# Altium project MicroController.PrjPcb (part 1 of 2)
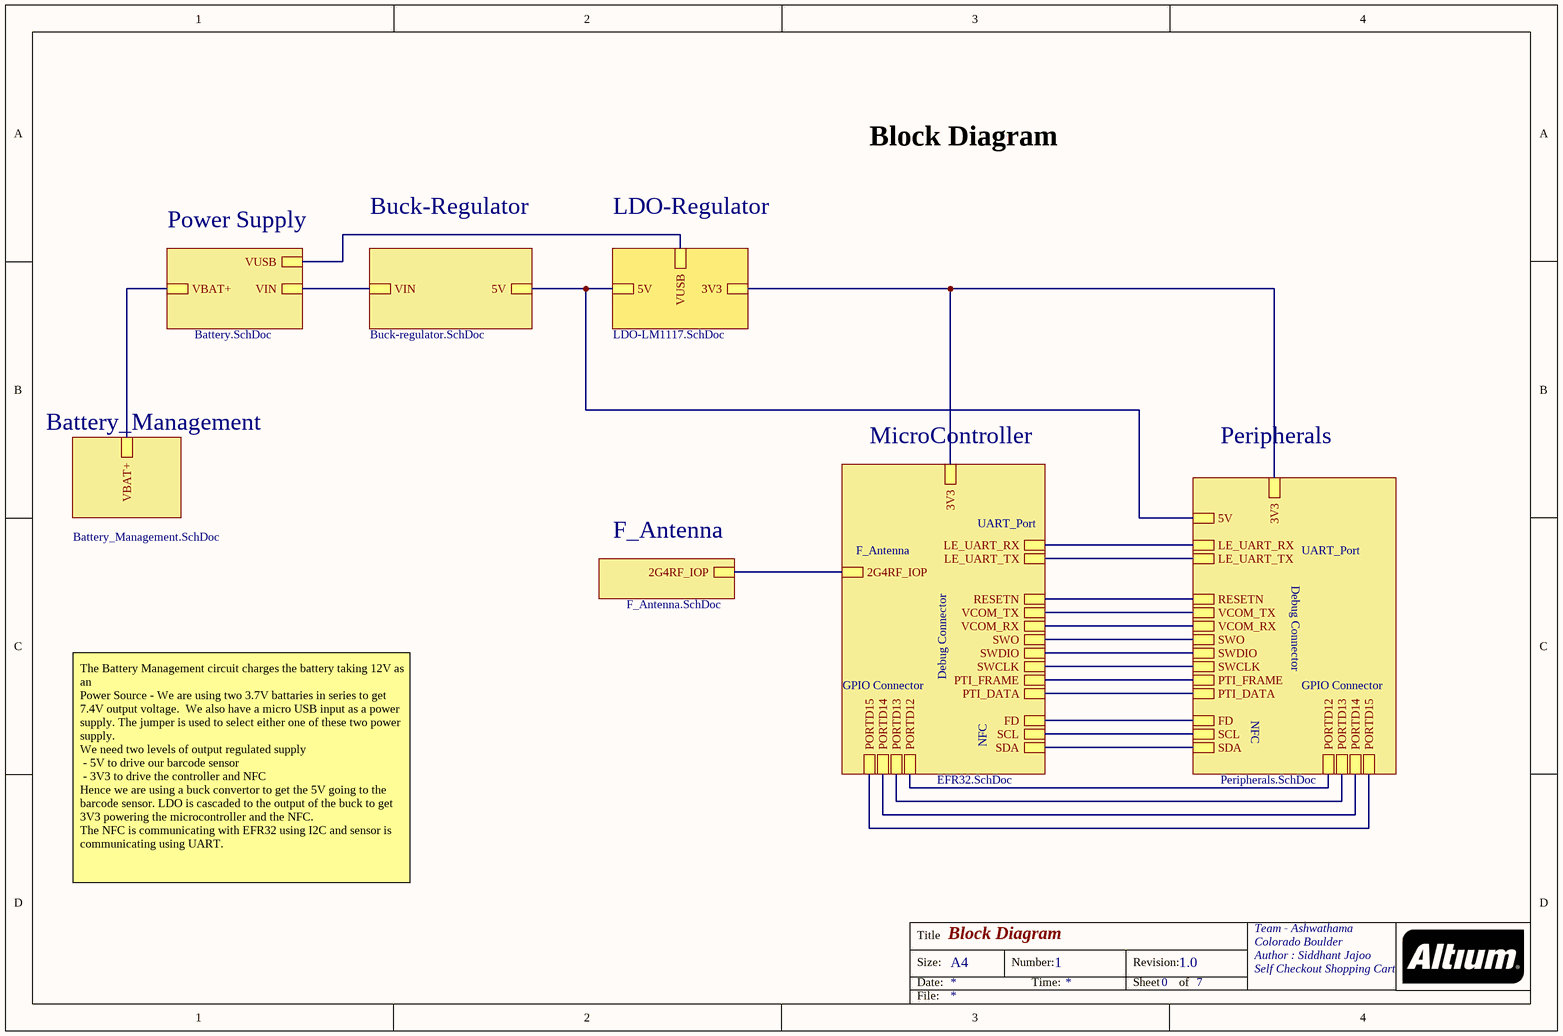
[diagram p0: Block_Diagram.SchDoc]
8 sheets, 76 parts. Net scope: hierarchical (ports join the sheet entries above them; power ports are global).
Board file: Shopping_Cart.PcbDoc
Sheets:
  Block_Diagram.SchDoc
    Buck-Regulator = Buck-regulator.SchDoc
    LDO-Regulator = LDO-LM1117.SchDoc
    F_Antenna = F_Antenna.SchDoc
    Peripherals = Peripherals.SchDoc
    MicroController = EFR32.SchDoc
    Power Supply = Battery.SchDoc
    Battery_Management = Battery_Management.SchDoc

## Sheet Block_Diagram.SchDoc: Block Diagram
size A4; DrawnBy: Siddhant Jajoo; Organization: Team - Ashwathama; Address1: Colorado Boulder; Address2: Author : Siddhant Jajoo; Address3: Self Checkout Shopping Cart; DocumentNumber: 1; Revision: 1.0; SheetNumber: 0; SheetTotal: 7; DocumentName: Block Diagram; ProjectName: Self Checkout Shopping Cart

### Sub-sheets
Battery_Management = Battery_Management.SchDoc: VBAT+
Buck-Regulator = Buck-regulator.SchDoc: VIN, 5V
F_Antenna = F_Antenna.SchDoc: 2G4RF_IOP
LDO-Regulator = LDO-LM1117.SchDoc: 3V3, 5V, VUSB
MicroController = EFR32.SchDoc: LE_UART_RX, LE_UART_TX, 2G4RF_IOP, SCL, SDA, 3V3, FD, RESETN, VCOM_TX, VCOM_RX, PTI_FRAME, PTI_DATA, SWO, SWDIO, SWCLK, PORTD12, PORTD13, PORTD14, PORTD15
Peripherals = Peripherals.SchDoc: PTI_FRAME, SWDIO, VCOM_TX, RESETN, FD, VCOM_RX, SWO, SWCLK, PTI_DATA, SCL, SDA, 3V3, LE_UART_RX, LE_UART_TX, 5V, PORTD12, PORTD13, PORTD14, PORTD15
Power Supply = Battery.SchDoc: VBAT+, VIN, VUSB

### Nets
3V3: sheet LDO-Regulator/3V3, sheet Peripherals/3V3, sheet MicroController/3V3
RESET_N: sheet Peripherals/RESETN, sheet MicroController/RESETN
NetC2_2: sheet Power Supply/VBAT+, sheet Battery_Management/VBAT+
NetC3_2: sheet Buck-Regulator/VIN, sheet Power Supply/VIN
NetD1_1: sheet LDO-Regulator/VUSB, sheet Power Supply/VUSB
NetJ4_3: sheet Buck-Regulator/5V, sheet LDO-Regulator/5V, sheet Peripherals/5V
NetJ7_1: sheet Peripherals/FD, sheet MicroController/FD
NetJ7_3: sheet Peripherals/SCL, sheet MicroController/SCL
NetJ7_4: sheet Peripherals/SDA, sheet MicroController/SDA
NetJ8_2: sheet Peripherals/LE_UART_TX, sheet MicroController/LE_UART_TX
NetJ8_3: sheet Peripherals/LE_UART_RX, sheet MicroController/LE_UART_RX
NetJ9_4: sheet Peripherals/VCOM_RX, sheet MicroController/VCOM_RX
NetJ9_5: sheet Peripherals/VCOM_TX, sheet MicroController/VCOM_TX
NetJ9_6: sheet Peripherals/SWO, sheet MicroController/SWO
NetJ9_7: sheet Peripherals/SWDIO, sheet MicroController/SWDIO
NetJ9_8: sheet Peripherals/SWCLK, sheet MicroController/SWCLK
NetJ9_9: sheet Peripherals/PTI_FRAME, sheet MicroController/PTI_FRAME
NetJ9_10: sheet Peripherals/PTI_DATA, sheet MicroController/PTI_DATA
NetJ10_1: sheet Peripherals/PORTD12, sheet MicroController/PORTD12
NetJ10_2: sheet Peripherals/PORTD13, sheet MicroController/PORTD13
NetJ10_3: sheet Peripherals/PORTD14, sheet MicroController/PORTD14
NetJ10_4: sheet Peripherals/PORTD15, sheet MicroController/PORTD15
NetL2_1: sheet F_Antenna/2G4RF_IOP, sheet MicroController/2G4RF_IOP

### Notes on the sheet
- Block Diagram
- F_Antenna
- UART_Port
- Debug Connector
- GPIO Connector
- NFC
- The Battery Management circuit charges the battery taking 12V as an
  Power Source - We are using two 3.7V battaries in series to get 7.4V output voltage.  We also have a micro USB input as a power supply. The jumper is used to select either one of these two power supply.
  We need two levels of output regulated supply
  - 5V to drive our barcode sensor
  - 3V3 to drive the controller and NFC
  Hence we are using a buck convertor to get the 5V going to the barcode sensor. LDO is cascaded to the output of the buck to get 3V3 powering the microcontroller and the NFC.
  The NFC is communicating with EFR32 using I2C and sensor is communicating using UART.
- Title
- Size:
- Date:
- A4
- Number:
- Time:
- Revision:
- Sheet
- of
- File:

## Sheet Buck-regulator.SchDoc: Buck Regulator
size A4; Organization: Team- Ashwathama; Address1: Colorado Boulder; Address2: Author- Satya Mehta; Address3: Self Checkout Shopping Cart; DocumentNumber: 1; Revision: 1.0; SheetNumber: 3; SheetTotal: 7
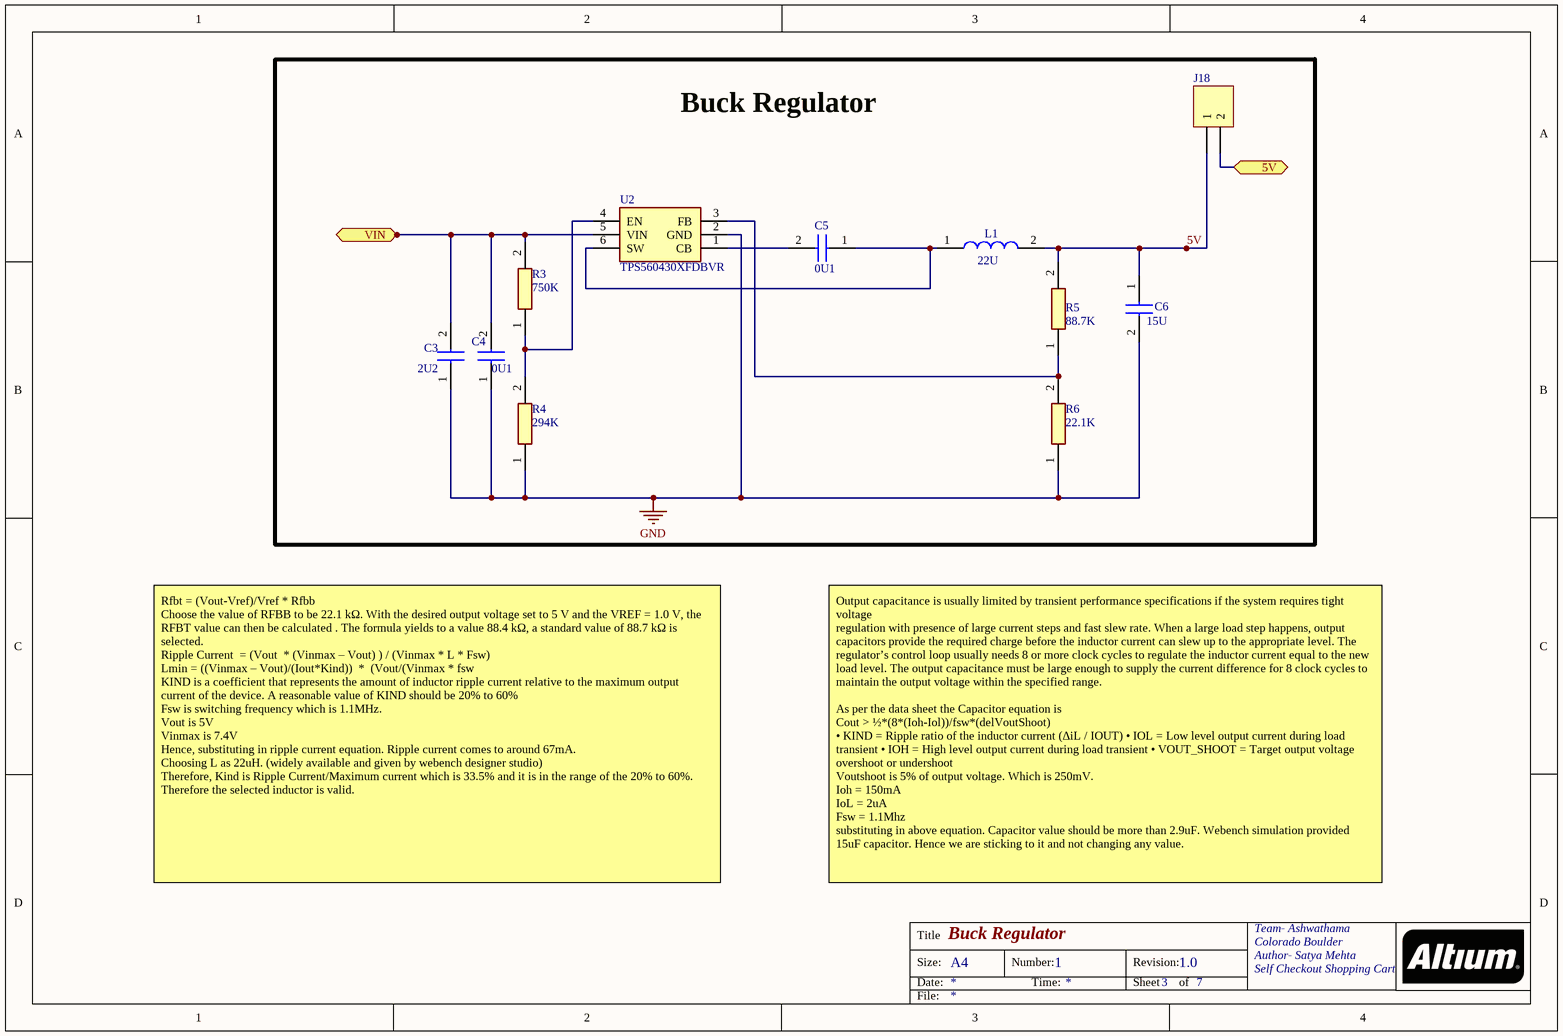
[diagram p1: Buck-regulator.SchDoc]

### Parts
C3  value 2U2  [CAPC2012X145N]  (hidden comment: GRM21BR71C225KA12L)
C4  value 0U1  [CAPC1608X87N]  (hidden comment: C0603C104K4RECTU)
C5  value 0U1  [CAPC1608X87N]  (hidden comment: C0603C104K4RECTU)
C6  value 15U  [CAPC1608X90N]  (hidden comment: GRM1885C2A150JA01D)
J18  Header 2  [HDR1X2]  (value not drawn)
L1  value 22U  [SRN3015]  (hidden comment: SRN3015-220M)
R3  value 750K  [RESC1608X55N]  (hidden comment: CR0603-FX-7503ELF)
R4  value 294K  [RESC1608X55N]  (hidden comment: CR0603-FX-2943ELF)
R5  value 88.7K  [RESC1608X50N]  (hidden comment: CRCW060388K7FKEA)
R6  value 22.1K  [RESC1608X55N]  (hidden comment: RC0603FR-0722K1L)
U2  TPS560430XFDBVR  [SOT95P280X145-6N]

### Blocks framed on the sheet
Buck Regulator: C3-C6 J18 L1 R3-R6 U2

### Ports
5V, VIN

### Nets
GND: C3.1 C4.1 C6.2 R4.1 R6.1 U2.2(GND)
5V: C6.1 J18.1 L1.2 R5.2
NetC3_2: C3.2 C4.2 R3.2 U2.5(VIN) ; port VIN
NetC5_1: C5.1 L1.1 U2.6(SW)
NetC5_2: C5.2 U2.1(CB)
NetJ4_3: J18.2 ; port 5V
NetR3_1: R3.1 R4.2 U2.4(EN)
NetR5_1: R5.1 R6.2 U2.3(FB)

### Notes on the sheet
- Rfbt = (Vout-Vref)/Vref * Rfbb
  Choose the value of RFBB to be 22.1 kΩ. With the desired output voltage set to 5 V and the VREF = 1.0 V, the RFBT value can then be calculated . The formula yields to a value 88.4 kΩ, a standard value of 88.7 kΩ is selected.
  Ripple Current  = (Vout  * (Vinmax – Vout) ) / (Vinmax * L * Fsw)
  Lmin = ((Vinmax – Vout)/(Iout*Kind))  *  (Vout/(Vinmax * fsw
  KIND is a coefficient that represents the amount of inductor ripple current relative to the maximum output current of the device. A reasonable value of KIND should be 20% to 60%
  Fsw is switching frequency which is 1.1MHz.
  Vout is 5V
  Vinmax is 7.4V
  Hence, substituting in ripple current equation. Ripple current comes to around 67mA.
  Choosing L as 22uH. (widely available and given by webench designer studio)
  Therefore, Kind is Ripple Current/Maximum current which is 33.5% and it is in the range of the 20% to 60%. Therefore the selected inductor is valid.
- Output capacitance is usually limited by transient performance specifications if the system requires tight voltage
  regulation with presence of large current steps and fast slew rate. When a large load step happens, output
  capacitors provide the required charge before the inductor current can slew up to the appropriate level. The
  regulator’s control loop usually needs 8 or more clock cycles to regulate the inductor current equal to the new
  load level. The output capacitance must be large enough to supply the current difference for 8 clock cycles to
  maintain the output voltage within the specified range.
  As per the data sheet the Capacitor equation is
  Cout > ½*(8*(Ioh-Iol))/fsw*(delVoutShoot)
  • KIND = Ripple ratio of the inductor current (ΔiL / IOUT) • IOL = Low level output current during load transient • IOH = High level output current during load transient • VOUT_SHOOT = Target output voltage overshoot or undershoot
  Voutshoot is 5% of output voltage. Which is 250mV.
  Ioh = 150mA
  IoL = 2uA
  Fsw = 1.1Mhz
  substituting in above equation. Capacitor value should be more than 2.9uF. Webench simulation provided 15uF capacitor. Hence we are sticking to it and not changing any value.
- Title
- Size:
- Date:
- A4
- Number:
- Time:
- Revision:
- Sheet
- of
- File:

### Library data of the parts
C3 = GRM21BR71C225KA12L: Capacitor; Manufacturer_Name: Murata Electronics; Datasheet Link: http://www.murata.com/~/media/webrenewal/support/library/catalog/products/capacitor/mlcc/c02e.pdf; Height: 1.45mm; Manufacturer_Part_Number: GRM21BR71C225KA12L; Mouser Part Number: 81-GRM21BR71C225KA2L; Mouser Price/Stock: https://www.mouser.com/Search/Refine.aspx?Keyword=81-GRM21BR71C225KA2L; RS Part Number: 7236076; RS Price/Stock: https://uk.rs-online.com/web/p/products/7236076
C4 C5 = C0603C104K4RECTU: Capacitor; Manufacturer_Name: Kemet; Datasheet Link: https://api.kemet.com/component-edge/download/datasheet/C0603C104K4RECTU.pdf; Height: 0.87mm; Manufacturer_Part_Number: C0603C104K4RECTU; Mouser Part Number: 80-C0603C104K4RECTU; Mouser Price/Stock: https://www.mouser.com/Search/Refine.aspx?Keyword=80-C0603C104K4RECTU
C6 = GRM1885C2A150JA01D: Capacitor; Manufacturer_Name: Murata Electronics; Datasheet Link: http://www.murata.com/~/media/webrenewal/support/library/catalog/products/capacitor/mlcc/c02e.pdf; Height: 0.9mm; Manufacturer_Part_Number: GRM1885C2A150JA01D; Mouser Part Number: 81-GRM1885C2A150JA01; Mouser Price/Stock: https://www.mouser.com/Search/Refine.aspx?Keyword=81-GRM1885C2A150JA01; RS Part Number: 8151516; RS Price/Stock: https://uk.rs-online.com/web/p/products/8151516
J18 = Header 2: Header, 2-Pin; Manufacturer_Part_Number: BG301-04-A-0540-L-B; Manufacturer_Name: Global Connector Technology; Digi-Key Part Number: 2073-BG301-02-A-0540-L-BCT-ND; Value: *; Digikey Price/Stock: https://www.digikey.com/product-detail/en/gct/BG301-04-A-0540-L-B/2073-BG301-04-A-0540-L-BCT-ND/9859670?utm_source=snapeda&utm_medium=aggregator&utm_campaign=symbol
L1 = SRN3015-220M: Inductor; Manufacturer_Name: Bourns; Allied_Number: 70231649; Manufacturer_Part_Number: SRN3015-220M; Digi-Key Part Number: SRN3015-220MCT-ND; Digikey Price/Stock: https://www.digikey.com/products/en/inductors-coils-chokes/fixed-inductors/71?k=SRN3015-220M&k=&pkeyword=SRN3015-220M&sv=0&pv7=2&sf=0&quantity=&ColumnSort=0&page=1&pageSize=25; RS Part Number: 7435087P; RS Price/Stock: http://uk.rs-online.com/web/p/products/7435087P; Allied Price/Stock: https://www.alliedelec.com/bourns-srn3015-220m/70231649/
R3 = CR0603-FX-7503ELF: Resistor; Manufacturer_Name: Bourns; Datasheet Link: https://www.bourns.com/pdfs/chpreztr.pdf; Height: 0.55mm; Manufacturer_Part_Number: CR0603-FX-7503ELF; Mouser Part Number: 652-CR0603FX-7503ELF; Mouser Price/Stock: https://www.mouser.com/Search/Refine.aspx?Keyword=652-CR0603FX-7503ELF
R4 = CR0603-FX-2943ELF: Resistor; Manufacturer_Name: Bourns; Datasheet Link: https://www.bourns.com/pdfs/chpreztr.pdf; Height: 0.55mm; Manufacturer_Part_Number: CR0603-FX-2943ELF; Mouser Part Number: 652-CR0603FX-2943ELF; Mouser Price/Stock: https://www.mouser.com/Search/Refine.aspx?Keyword=652-CR0603FX-2943ELF
R5 = CRCW060388K7FKEA: Resistor; Manufacturer_Name: Vishay; Allied_Number: 70203516; Datasheet Link: http://www.vishay.com/docs/20035/dcrcwe3.pdf; Height: 0.5mm; Manufacturer_Part_Number: CRCW060388K7FKEA; Mouser Part Number: 71-CRCW0603-88.7K-E3; RS Part Number: 8306693; RS Price/Stock: https://uk.rs-online.com/web/p/products/8306693; Allied Price/Stock: https://www.alliedelec.com/vishay-dale-crcw060388k7fkea/70203516/; Mouser Price/Stock: https://www.mouser.com/ProductDetail/Vishay-Dale/CRCW060388K7FKEA?qs=sGAEpiMZZMu61qfTUdNhG%2Fy1ga03FwuGzQj1%2FlSzSQI%3D
R6 = RC0603FR-0722K1L: Resistor; Manufacturer_Name: YAGEO (PHYCOMP); Datasheet Link: http://www.yageo.com/documents/recent/PYu-RC0603_51_RoHS_L_v5.pdf; Height: 0.55mm; Manufacturer_Part_Number: RC0603FR-0722K1L; Mouser Part Number: 603-RC0603FR-0722K1L; Mouser Price/Stock: https://www.mouser.com/Search/Refine.aspx?Keyword=603-RC0603FR-0722K1L
U2 = TPS560430XFDBVR: Integrated Circuit; Manufacturer_Name: Texas Instruments; Datasheet Link: http://www.ti.com/lit/ds/symlink/tps560430.pdf; Height: 1.45mm; Manufacturer_Part_Number: TPS560430XFDBVR; Mouser Part Number: 595-TPS560430XFDBVR; Mouser Price/Stock: https://www.mouser.com/Search/Refine.aspx?Keyword=595-TPS560430XFDBVR

## Sheet LDO-LM1117.SchDoc: LDO Regulator
size A4; Organization: Team Ashwathama; Address1: Colorado Boulder; Address2: Author- Satya Mehta; Address3: Self Checkout Shopping Cart; DocumentNumber: 1; Revision: 1.0; SheetNumber: 4; SheetTotal: 7
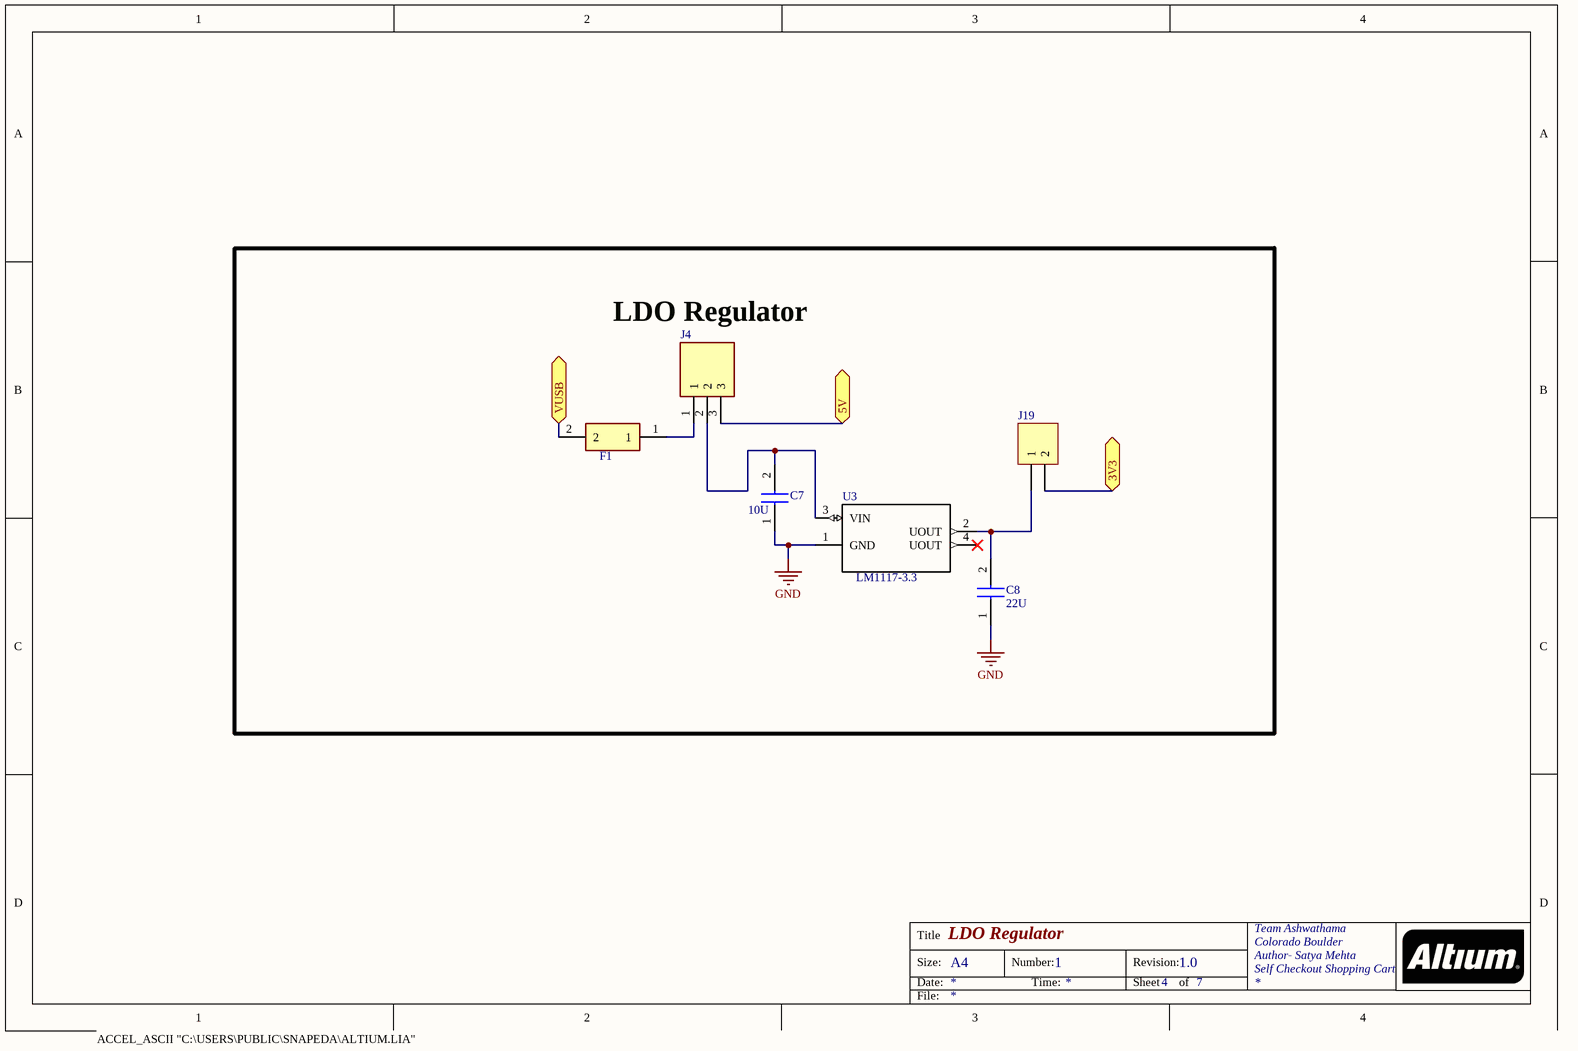
[diagram p2: LDO-LM1117.SchDoc]

### Parts
C7  value 10U  [CAPC6153X300N]  (hidden comment: KCM55LR71E156KH01K)
C8  value 22U  [CAPC3225X270N]  (hidden comment: GRM32ER71C226KEA8L)
F1  MF-MSMF050-2  [FUSC4632X85N]  (value not drawn)
J4  61900311121  [SHDR3W64P0X254_1X3_766X580X1175P]  (value not drawn)
J19  Header 2  [HDR1X2]  (value not drawn)
U3  LM1117-3.3  [*SOT-223]

### Blocks framed on the sheet
LDO Regulator: C7 C8 F1 J4 J19 U3

### Ports
3V3, 5V, VUSB

### Nets
GND: C7.1 C8.1 U3.1(GND)
3V3: J19.2 ; port 3V3
NetC7_2: C7.2 J4.2 U3.3(VIN)
NetC8_2: C8.2 J19.1 U3.2(UOUT)
NetD1_1: F1.2 ; port VUSB
NetF1_1: F1.1 J4.1
NetJ4_3: J4.3 ; port 5V

Not connected (* = marked no-connect by the designer): U3 4(UOUT)*

### Notes on the sheet
- ACCEL_ASCII "C:\USERS\PUBLIC\SNAPEDA\ALTIUM.LIA"
  (asciiHeader
  (asciiVersion 5 0)
  (fileAuthor "(c) SnapEDA 2016 (snapeda.com)")
  (copyright "This work is licensed under a Creative Commons Attribution-ShareAlike 4.0 International License (CC BY-SA) with Design Exception 1.0")
  (fileUnits mm)
  )
  (library "Library"
  (padStyleDef "SSX45Y13"
  (holeDiam 0)
  (startRange 1)
  (endRange 2)
  (padShape (layerNumRef 1) (padShapeType Rect) (shapeWidth 0.45) (shapeHeight 1.38))
  (padShape (layerNumRef 2) (padShapeType Rect) (shapeWidth 0) (shapeHeight 0))
  (padShape (layerType Signal) (padShapeType Rect) (shapeWidth 0) (shapeHeight 0))
  (padShape (padShapeType Rect) (shapeWidth 0.45) (shapeHeight 1.38))
  (padShape (padShapeType Rect) (shapeWidth 0.45) (shapeHeight 1.38))
  (padShape (layerType Plane) (padShapeType NoConnect) (shapeWidth 0) (shapeHeight 0))
  (padShape (layerType NonSignal) (padShapeType Oval) (shapeWidth 0) (shapeHeight 0))
  )
  (padStyleDef "SSX14Y21"
  (holeDiam 0)
  (startRange 1)
  (endRange 2)
  (padShape (layerNumRef 1) (padShapeType Rect) (shapeWidth 1.4) (shapeHeight 2.1))
  (padShape (layerNumRef 2) (padShapeType Rect) (shapeWidth 0) (shapeHeight 0))
  (padShape (layerType Signal) (padShapeType Rect) (shapeWidth 0) (shapeHeight 0))
  (padShape (padShapeType Rect) (shapeWidth 1.4) (shapeHeight 2.1))
  (padShape (padShapeType Rect) (shapeWidth 1.4) (shapeHeight 2.1))
  (padShape (layerType Plane) (padShapeType NoConnect) (shapeWidth 0) (shapeHeight 0))
  (padShape (layerType NonSignal) (padShapeType Oval) (shapeWidth 0) (shapeHeight 0))
  )
  (padStyleDef "SSX13Y21"
  (holeDiam 0)
  (startRange 1)
  (endRange 2)
  (padShape (layerNumRef 1) (padShapeType Rect) (shapeWidth 1.375) (shapeHeight 2.1))
  (padShape (layerNumRef 2) (padShapeType Rect) (shapeWidth 0) (shapeHeight 0))
  (padShape (layerType Signal) (padShapeType Rect) (shapeWidth 0) (shapeHeight 0))
  (padShape (padShapeType Rect) (shapeWidth 1.375) (shapeHeight 2.1))
  (padShape (padShapeType Rect) (shapeWidth 1.375) (shapeHeight 2.1))
  (padShape (layerType Plane) (padShapeType NoConnect) (shapeWidth 0) (shapeHeight 0))
  (padShape (layerType NonSignal) (padShapeType Oval) (shapeWidth 0) (shapeHeight 0))
  )
  (padStyleDef "DUD60"
  (holeDiam 0.6)
  (isHolePlated False)
  (startRange 1)
  (endRange 2)
  (padShape (layerNumRef 1) (padShapeType Oval) (shapeWidth 0.6) (shapeHeight 0.6))
  (padShape (layerNumRef 2) (padShapeType Oval) (shapeWidth 0.6) (shapeHeight 0.6))
  (padShape (layerType Signal) (padShapeType Oval) (shapeWidth 0.6) (shapeHeight 0.6))
  (padShape (layerType Plane) (padShapeType NoConnect) (shapeWidth 0) (shapeHeight 0))
  (padShape (layerType NonSignal) (padShapeType Oval) (shapeWidth 0) (shapeHeight 0))
  )
  (padStyleDef "SSX10Y10"
  (holeDiam 0)
  (startRange 1)
  (endRange 2)
  (padShape (layerNumRef 1) (padShapeType Rect) (shapeWidth 0.1) (shapeHeight 0.1))
  (padShape (layerNumRef 2) (padShapeType Rect) (shapeWidth 0) (shapeHeight 0))
  (padShape (layerType Signal) (padShapeType Rect) (shapeWidth 0) (shapeHeight 0))
  (padShape (padShapeType Rect) (shapeWidth 0) (shapeHeight 0))
  (padShape (padShapeType Rect) (shapeWidth 0) (shapeHeight 0))
  (padShape (layerType Plane) (padShapeType NoConnect) (shapeWidth 0) (shapeHeight 0))
  (padShape (layerType NonSignal) (padShapeType Oval) (shapeWidth 0) (shapeHeight 0))
  )
  (textStyleDef "(Default)"
  (font
  (fontType Stroke)
  (fontFamily Modern)
  (fontFace "Quality")
  (fontHeight 3.54)
  )
  (textStyleAllowTType True)
  (textStyleDisplayTType False)
  )
  (textStyleDef "(PinStyle)"
  (font
  (fontType Stroke)
  (fontFamily SanSerif)
  (fontFace "QUALITY")
  (fontHeight 3.54)
  (strokeWidth 0.001)
  )
  (font
  (fontType TrueType)
  (fontFamily Modern)
  (fontFace "Times New Roman")
  (fontHeight 3.54)
  (strokeWidth 0.19843)
  (fontWeight 400)
  (fontCharSet 0)
  (fontOutPrecision 7)
  (fontClipPrecision 32)
  (fontQuality 1)
  (fontPitchAndFamily 6)
  )
  (textStyleAllowTType True)
  (textStyleDisplayTType False)
  )
  (textStyleDef "(LabelStyle)"
  (font
  (fontType Stroke)
  (fontFamily SanSerif)
  (fontFace "QUALITY")
  (fontHeight 3.54)
  (strokeWidth 0.001)
  )
  (font
  (fontType TrueType)
  (fontFamily Modern)
  (fontFace "Times New Roman")
  (fontHeight 3)
  (strokeWidth 0.19843)
  (fontWeight 400)
  (fontCharSet 0)
  (fontOutPrecision 7)
  (fontClipPrecision 32)
  (fontQuality 1)
  (fontPitchAndFamily 6)
  )
  (textStyleAllowTType True)
  (textStyleDisplayTType False)
  )
  (patternDefExtended "*TE_1932788-1"
  (originalName "*TE_1932788-1")
  (patternGraphicsNameRef "Primary")
  (patternGraphicsDef
  (patternGraphicsNameDef "Primary")
  (multiLayer
  (pad (padNum 3) (padStyleRef "SSX45Y13") (pt 0 0))
  (pad (padNum SH1) (padStyleRef "SSX14Y21") (pt -2.5 -0.36))
  (pad (padNum SH2) (padStyleRef "SSX14Y21") (pt 2.5 -0.36))
  (pad (padNum SH5) (padStyleRef "SSX13Y21") (pt -0.9375 -2.71))
  (pad (padNum 2) (padStyleRef "SSX45Y13") (pt -0.65 0))
  (pad (padNum 4) (padStyleRef "SSX45Y13") (pt 0.65 0))
  (pad (padNum 1) (padStyleRef "SSX45Y13") (pt -1.3 0))
  (pad (padNum 5) (padStyleRef "SSX45Y13") (pt 1.3 0))
  (pad (padNum SH4) (padStyleRef "SSX13Y21") (pt 0.9375 -2.71))
  (pad (padNum None) (padStyleRef "DUD60") (pt -3.95 -2.66))
  (pad (padNum None) (padStyleRef "DUD60") (pt 3.95 -2.66))
  (pad (padNum SH3) (padStyleRef "SSX10Y10") (pt 4 -3.5))
  (pad (padNum SH6) (padStyleRef "SSX10Y10") (pt -4 -3.5))
  )
  (layerContents (layerNumRef 1)
  (pcbPoly
  (pt 3.65 -2.66)
  (pt 3.65 -2.31)
  (pt 3.65 -2.30215)
  (pt 3.65082 -2.28646)
  (pt 3.65246 -2.27083)
  (pt 3.65492 -2.25531)
  (pt 3.65819 -2.23994)
  (pt 3.66226 -2.22477)
  (pt 3.66711 -2.20983)
  (pt 3.67274 -2.19516)
  (pt 3.67913 -2.1808)
  (pt 3.68626 -2.1668)
  (pt 3.69412 -2.1532)
  (pt 3.70268 -2.14002)
  (pt 3.71191 -2.12731)
  (pt 3.7218 -2.1151)
  (pt 3.73231 -2.10342)
  (pt 3.74342 -2.09231)
  (pt 3.7551 -2.0818)
  (pt 3.76731 -2.07191)
  (pt 3.78002 -2.06268)
  (pt 3.7932 -2.05412)
  (pt 3.8068 -2.04627)
  (pt 3.8208 -2.03913)
  (pt 3.83515 -2.03274)
  (pt 3.84982 -2.02711)
  (pt 3.86476 -2.02226)
  (pt 3.87994 -2.01819)
  (pt 3.89531 -2.01492)
  (pt 3.91083 -2.01246)
  (pt 3.92645 -2.01082)
  (pt 3.94214 -2.01)
  (pt 3.95 -2.01)
  (pt 3.95785 -2.01)
  (pt 3.97354 -2.01082)
  (pt 3.98917 -2.01246)
  (pt 4.00469 -2.01492)
  (pt 4.02006 -2.01819)
  (pt 4.03523 -2.02226)
  (pt 4.05017 -2.02711)
  (pt 4.06484 -2.03274)
  (pt 4.0792 -2.03913)
  (pt 4.0932 -2.04626)
  (pt 4.1068 -2.05412)
  (pt 4.11998 -2.06268)
  (pt 4.13269 -2.07191)
  (pt 4.1449 -2.0818)
  (pt 4.15658 -2.09231)
  (pt 4.16769 -2.10342)
  (pt 4.1782 -2.1151)
  (pt 4.18809 -2.12731)
  (pt 4.19732 -2.14002)
  (pt 4.20588 -2.1532)
  (pt 4.21373 -2.1668)
  (pt 4.22087 -2.1808)
  (pt 4.22726 -2.19515)
  (pt 4.23289 -2.20982)
  (pt 4.23774 -2.22476)
  (pt 4.24181 -2.23994)
  (pt 4.24508 -2.25531)
  (pt 4.24754 -2.27083)
  (pt 4.24918 -2.28645)
  (pt 4.25 -2.30214)
  (pt 4.25 -2.31)
  (pt 4.25 -3.01)
  (pt 4.25 -3.01785)
  (pt 4.24918 -3.03354)
  (pt 4.24754 -3.04917)
  (pt 4.24508 -3.06469)
  (pt 4.24181 -3.08006)
  (pt 4.23774 -3.09523)
  (pt 4.23289 -3.11017)
  (pt 4.22726 -3.12484)
  (pt 4.22087 -3.1392)
  (pt 4.21374 -3.1532)
  (pt 4.20588 -3.1668)
  (pt 4.19732 -3.17998)
  (pt 4.18809 -3.19269)
  (pt 4.1782 -3.2049)
  (pt 4.16769 -3.21658)
  (pt 4.15658 -3.22769)
  (pt 4.1449 -3.2382)
  (pt 4.13269 -3.24809)
  (pt 4.11998 -3.25732)
  (pt 4.1068 -3.26588)
  (pt 4.0932 -3.27373)
  (pt 4.0792 -3.28087)
  (pt 4.06485 -3.28726)
  (pt 4.05018 -3.29289)
  (pt 4.03524 -3.29774)
  (pt 4.02006 -3.30181)
  (pt 4.00469 -3.30508)
  (pt 3.98917 -3.30754)
  (pt 3.97355 -3.30918)
  (pt 3.95786 -3.31)
  (pt 3.95 -3.31)
  (pt 3.94215 -3.31)
  (pt 3.92646 -3.30918)
  (pt 3.91083 -3.30754)
  (pt 3.89531 -3.30508)
  (pt 3.87994 -3.30181)
  (pt 3.86477 -3.29774)
  (pt 3.84983 -3.29289)
  (pt 3.83516 -3.28726)
  (pt 3.8208 -3.28087)
  (pt 3.8068 -3.27374)
  (pt 3.7932 -3.26588)
  (pt 3.78002 -3.25732)
  (pt 3.76731 -3.24809)
  (pt 3.7551 -3.2382)
  (pt 3.74342 -3.22769)
  (pt 3.73231 -3.21658)
  (pt 3.7218 -3.2049)
  (pt 3.71191 -3.19269)
  (pt 3.70268 -3.17998)
  (pt 3.69412 -3.1668)
  (pt 3.68627 -3.1532)
  (pt 3.67913 -3.1392)
  (pt 3.67274 -3.12485)
  (pt 3.66711 -3.11018)
  (pt 3.66226 -3.09524)
  (pt 3.65819 -3.08006)
  (pt 3.65492 -3.06469)
  (pt 3.65246 -3.04917)
  (pt 3.65082 -3.03355)
  (pt 3.65 -3.01786)
  (pt 3.65 -3.01)
  (pt 3.65 -2.66)
  (pt 3.25 -2.66)
  (pt 3.25 -3.01)
  (pt 3.25 -3.02833)
  (pt 3.25192 -3.06494)
  (pt 3.25575 -3.1014)
  (pt 3.26148 -3.1376)
  (pt 3.26911 -3.17346)
  (pt 3.2786 -3.20887)
  (pt 3.28992 -3.24374)
  (pt 3.30306 -3.27797)
  (pt 3.31797 -3.31146)
  (pt 3.33462 -3.34412)
  (pt 3.35295 -3.37587)
  (pt 3.37291 -3.40662)
  (pt 3.39446 -3.43628)
  (pt 3.41753 -3.46477)
  (pt 3.44206 -3.49201)
  (pt 3.46798 -3.51793)
  (pt 3.49523 -3.54246)
  (pt 3.52372 -3.56554)
  (pt 3.55338 -3.58708)
  (pt 3.58412 -3.60705)
  (pt 3.61587 -3.62538)
  (pt 3.64854 -3.64202)
  (pt 3.68203 -3.65694)
  (pt 3.71625 -3.67007)
  (pt 3.75112 -3.6814)
  (pt 3.78653 -3.69089)
  (pt 3.82239 -3.69851)
  (pt 3.8586 -3.70425)
  (pt 3.89506 -3.70808)
  (pt 3.93167 -3.71)
  (pt 3.95 -3.71)
  (pt 3.96833 -3.71)
  (pt 4.00494 -3.70808)
  (pt 4.0414 -3.70425)
  (pt 4.0776 -3.69852)
  (pt 4.11346 -3.69089)
  (pt 4.14887 -3.6814)
  (pt 4.18374 -3.67008)
  (pt 4.21797 -3.65694)
  (pt 4.25146 -3.64203)
  (pt 4.28412 -3.62538)
  (pt 4.31587 -3.60705)
  (pt 4.34662 -3.58709)
  (pt 4.37628 -3.56554)
  (pt 4.40477 -3.54247)
  (pt 4.43201 -3.51794)
  (pt 4.45793 -3.49202)
  (pt 4.48246 -3.46477)
  (pt 4.50554 -3.43628)
  (pt 4.52708 -3.40662)
  (pt 4.54705 -3.37588)
  (pt 4.56538 -3.34413)
  (pt 4.58202 -3.31146)
  (pt 4.59694 -3.27797)
  (pt 4.61007 -3.24375)
  (pt 4.6214 -3.20888)
  (pt 4.63089 -3.17347)
  (pt 4.63851 -3.13761)
  (pt 4.64425 -3.1014)
  (pt 4.64808 -3.06494)
  (pt 4.65 -3.02833)
  (pt 4.65 -3.01)
  (pt 4.65 -2.31)
  (pt 4.65 -2.29167)
  (pt 4.64808 -2.25506)
  (pt 4.64425 -2.2186)
  (pt 4.63852 -2.1824)
  (pt 4.63089 -2.14654)
  (pt 4.6214 -2.11113)
  (pt 4.61008 -2.07626)
  (pt 4.59694 -2.04203)
  (pt 4.58203 -2.00854)
  (pt 4.56538 -1.97588)
  (pt 4.54705 -1.94413)
  (pt 4.52709 -1.91338)
  (pt 4.50554 -1.88372)
  (pt 4.48247 -1.85523)
  (pt 4.45794 -1.82799)
  (pt 4.43202 -1.80207)
  (pt 4.40477 -1.77754)
  (pt 4.37628 -1.75446)
  (pt 4.34662 -1.73292)
  (pt 4.31588 -1.71295)
  (pt 4.28413 -1.69462)
  (pt 4.25146 -1.67798)
  (pt 4.21797 -1.66306)
  (pt 4.18375 -1.64993)
  (pt 4.14888 -1.6386)
  (pt 4.11347 -1.62911)
  (pt 4.07761 -1.62149)
  (pt 4.0414 -1.61575)
  (pt 4.00494 -1.61192)
  (pt 3.96833 -1.61)
  (pt 3.95 -1.61)
  (pt 3.93167 -1.61)
  (pt 3.89506 -1.61192)
  (pt 3.8586 -1.61575)
  (pt 3.8224 -1.62148)
  (pt 3.78654 -1.62911)
  (pt 3.75113 -1.6386)
  (pt 3.71626 -1.64992)
  (pt 3.68203 -1.66306)
  (pt 3.64854 -1.67797)
  (pt 3.61588 -1.69462)
  (pt 3.58413 -1.71295)
  (pt 3.55338 -1.73291)
  (pt 3.52372 -1.75446)
  (pt 3.49523 -1.77753)
  (pt 3.46799 -1.80206)
  (pt 3.44207 -1.82798)
  (pt 3.41754 -1.85523)
  (pt 3.39446 -1.88372)
  (pt 3.37292 -1.91338)
  (pt 3.35295 -1.94412)
  (pt 3.33462 -1.97587)
  (pt 3.31798 -2.00854)
  (pt 3.30306 -2.04203)
  (pt 3.28993 -2.07625)
  (pt 3.2786 -2.11112)
  (pt 3.26911 -2.14653)
  (pt 3.26149 -2.18239)
  (pt 3.25575 -2.2186)
  (pt 3.25192 -2.25506)
  (pt 3.25 -2.29167)
  (pt 3.25 -2.31)
  (pt 3.25 -2.66)
  (pt 3.65 -2.66)
  )
  (pcbPoly
  (pt -4.25 -2.66)
  (pt -4.25 -2.31)
  (pt -4.25 -2.30215)
  (pt -4.24918 -2.28646)
  (pt -4.24754 -2.27083)
  (pt -4.24508 -2.25531)
  (pt -4.24181 -2.23994)
  (pt -4.23774 -2.22477)
  (pt -4.23289 -2.20983)
  (pt -4.22726 -2.19516)
  (pt -4.22087 -2.1808)
  (pt -4.21374 -2.1668)
  (pt -4.20588 -2.1532)
  (pt -4.19732 -2.14002)
  (pt -4.18809 -2.12731)
  (pt -4.1782 -2.1151)
  (pt -4.16769 -2.10342)
  (pt -4.15658 -2.09231)
  (pt -4.1449 -2.0818)
  (pt -4.13269 -2.07191)
  (pt -4.11998 -2.06268)
  (pt -4.1068 -2.05412)
  (pt -4.0932 -2.04627)
  (pt -4.0792 -2.03913)
  (pt -4.06485 -2.03274)
  (pt -4.05018 -2.02711)
  (pt -4.03524 -2.02226)
  (pt -4.02006 -2.01819)
  (pt -4.00469 -2.01492)
  (pt -3.98917 -2.01246)
  (pt -3.97355 -2.01082)
  (pt -3.95786 -2.01)
  (pt -3.95 -2.01)
  (pt -3.94215 -2.01)
  (pt -3.92646 -2.01082)
  (pt -3.91083 -2.01246)
  (pt -3.89531 -2.01492)
  (pt -3.87994 -2.01819)
  (pt -3.86477 -2.02226)
  (pt -3.84983 -2.02711)
  (pt -3.83516 -2.03274)
  (pt -3.8208 -2.03913)
  (pt -3.8068 -2.04626)
  (pt -3.7932 -2.05412)
  (pt -3.78002 -2.06268)
  (pt -3.76731 -2.07191)
  (pt -3.7551 -2.0818)
  (pt -3.74342 -2.09231)
  (pt -3.73231 -2.10342)
  (pt -3.7218 -2.1151)
  (pt -3.71191 -2.12731)
  (pt -3.70268 -2.14002)
  (pt -3.69412 -2.1532)
  (pt -3.68627 -2.1668)
  (pt -3.67913 -2.1808)
  (pt -3.67274 -2.19515)
  (pt -3.66711 -2.20982)
  (pt -3.66226 -2.22476)
  (pt -3.65819 -2.23994)
  (pt -3.65492 -2.25531)
  (pt -3.65246 -2.27083)
  (pt -3.65082 -2.28645)
  (pt -3.65 -2.30214)
  (pt -3.65 -2.31)
  (pt -3.65 -3.01)
  (pt -3.65 -3.01785)
  (pt -3.65082 -3.03354)
  (pt -3.65246 -3.04917)
  (pt -3.65492 -3.06469)
  (pt -3.65819 -3.08006)
  (pt -3.66226 -3.09523)
  (pt -3.66711 -3.11017)
  (pt -3.67274 -3.12484)
  (pt -3.67913 -3.1392)
  (pt -3.68626 -3.1532)
  (pt -3.69412 -3.1668)
  (pt -3.70268 -3.17998)
  (pt -3.71191 -3.19269)
  (pt -3.7218 -3.2049)
  (pt -3.73231 -3.21658)
  (pt -3.74342 -3.22769)
  (pt -3.7551 -3.2382)
  (pt -3.76731 -3.24809)
  (pt -3.78002 -3.25732)
  (pt -3.7932 -3.26588)
  (pt -3.8068 -3.27373)
  (pt -3.8208 -3.28087)
  (pt -3.83515 -3.28726)
  (pt -3.84982 -3.29289)
  (pt -3.86476 -3.29774)
  (pt -3.87994 -3.30181)
  (pt -3.89531 -3.30508)
  (pt -3.91083 -3.30754)
  (pt -3.92645 -3.30918)
  (pt -3.94214 -3.31)
  (pt -3.95 -3.31)
  (pt -3.95785 -3.31)
  (pt -3.97354 -3.30918)
  (pt -3.98917 -3.30754)
  (pt -4.00469 -3.30508)
  (pt -4.02006 -3.30181)
  (pt -4.03523 -3.29774)
  (pt -4.05017 -3.29289)
  (pt -4.06484 -3.28726)
  (pt -4.0792 -3.28087)
  (pt -4.0932 -3.27374)
  (pt -4.1068 -3.26588)
  (pt -4.11998 -3.25732)
  (pt -4.13269 -3.24809)
  (pt -4.1449 -3.2382)
  (pt -4.15658 -3.22769)
  (pt -4.16769 -3.21658)
  (pt -4.1782 -3.2049)
  (pt -4.18809 -3.19269)
  (pt -4.19732 -3.17998)
  (pt -4.20588 -3.1668)
  (pt -4.21373 -3.1532)
  (pt -4.22087 -3.1392)
  (pt -4.22726 -3.12485)
  (pt -4.23289 -3.11018)
  (pt -4.23774 -3.09524)
  (pt -4.24181 -3.08006)
  (pt -4.24508 -3.06469)
  (pt -4.24754 -3.04917)
  (pt -4.24918 -3.03355)
  (pt -4.25 -3.01786)
  (pt -4.25 -3.01)
  (pt -4.25 -2.66)
  (pt -4.65 -2.66)
  (pt -4.65 -3.01)
  (pt -4.65 -3.02833)
  (pt -4.64808 -3.06494)
  (pt -4.64425 -3.1014)
  (pt -4.63852 -3.1376)
  (pt -4.63089 -3.17346)
  (pt -4.6214 -3.20887)
  (pt -4.61008 -3.24374)
  (pt -4.59694 -3.27797)
  (pt -4.58203 -3.31146)
  (pt -4.56538 -3.34412)
  (pt -4.54705 -3.37587)
  (pt -4.52709 -3.40662)
  (pt -4.50554 -3.43628)
  (pt -4.48247 -3.46477)
  (pt -4.45794 -3.49201)
  (pt -4.43202 -3.51793)
  (pt -4.40477 -3.54246)
  (pt -4.37628 -3.56554)
  (pt -4.34662 -3.58708)
  (pt -4.31588 -3.60705)
  (pt -4.28413 -3.62538)
  (pt -4.25146 -3.64202)
  (pt -4.21797 -3.65694)
  (pt -4.18375 -3.67007)
  (pt -4.14888 -3.6814)
  (pt -4.11347 -3.69089)
  (pt -4.07761 -3.69851)
  (pt -4.0414 -3.70425)
  (pt -4.00494 -3.70808)
  (pt -3.96833 -3.71)
  (pt -3.95 -3.71)
  (pt -3.93167 -3.71)
  (pt -3.89506 -3.70808)
  (pt -3.8586 -3.70425)
  (pt -3.8224 -3.69852)
  (pt -3.78654 -3.69089)
  (pt -3.75113 -3.6814)
  (pt -3.71626 -3.67008)
  (pt -3.68203 -3.65694)
  (pt -3.64854 -3.64203)
  (pt -3.61588 -3.62538)
  (pt -3.58413 -3.60705)
  (pt -3.55338 -3.58709)
  (pt -3.52372 -3.56554)
  (pt -3.49523 -3.54247)
  (pt -3.46799 -3.51794)
  (pt -3.44207 -3.49202)
  (pt -3.41754 -3.46477)
  (pt -3.39446 -3.43628)
  (pt -3.37292 -3.40662)
  (pt -3.35295 -3.37588)
  (pt -3.33462 -3.34413)
  (pt -3.31798 -3.31146)
  (pt -3.30306 -3.27797)
  (pt -3.28993 -3.24375)
  (pt -3.2786 -3.20888)
  (pt -3.26911 -3.17347)
  (pt -3.26149 -3.13761)
  (pt -3.25575 -3.1014)
  (pt -3.25192 -3.06494)
  (pt -3.25 -3.02833)
  (pt -3.25 -3.01)
  (pt -3.25 -2.31)
  (pt -3.25 -2.29167)
  (pt -3.25192 -2.25506)
  (pt -3.25575 -2.2186)
  (pt -3.26148 -2.1824)
  (pt -3.26911 -2.14654)
  (pt -3.2786 -2.11113)
  (pt -3.28992 -2.07626)
  (pt -3.30306 -2.04203)
  (pt -3.31797 -2.00854)
  (pt -3.33462 -1.97588)
  (pt -3.35295 -1.94413)
  (pt -3.37291 -1.91338)
  (pt -3.39446 -1.88372)
  (pt -3.41753 -1.85523)
  (pt -3.44206 -1.82799)
  (pt -3.46798 -1.80207)
  (pt -3.49523 -1.77754)
  (pt -3.52372 -1.75446)
  (pt -3.55338 -1.73292)
  (pt -3.58412 -1.71295)
  (pt -3.61587 -1.69462)
  (pt -3.64854 -1.67798)
  (pt -3.68203 -1.66306)
  (pt -3.71625 -1.64993)
  (pt -3.75112 -1.6386)
  (pt -3.78653 -1.62911)
  (pt -3.82239 -1.62149)
  (pt -3.8586 -1.61575)
  (pt -3.89506 -1.61192)
  (pt -3.93167 -1.61)
  (pt -3.95 -1.61)
  (pt -3.96833 -1.61)
  (pt -4.00494 -1.61192)
  (pt -4.0414 -1.61575)
  (pt -4.0776 -1.62148)
  (pt -4.11346 -1.62911)
  (pt -4.14887 -1.6386)
  (pt -4.18374 -1.64992)
  (pt -4.21797 -1.66306)
  (pt -4.25146 -1.67797)
  (pt -4.28412 -1.69462)
  (pt -4.31587 -1.71295)
  (pt -4.34662 -1.73291)
  (pt -4.37628 -1.75446)
  (pt -4.40477 -1.77753)
  (pt -4.43201 -1.80206)
  (pt -4.45793 -1.82798)
  (pt -4.48246 -1.85523)
  (pt -4.50554 -1.88372)
  (pt -4.52708 -1.91338)
  (pt -4.54705 -1.94412)
  (pt -4.56538 -1.97587)
  (pt -4.58202 -2.00854)
  (pt -4.59694 -2.04203)
  (pt -4.61007 -2.07625)
  (pt -4.6214 -2.11112)
  (pt -4.63089 -2.14653)
  (pt -4.63851 -2.18239)
  (pt -4.64425 -2.2186)
  (pt -4.64808 -2.25506)
  (pt -4.65 -2.29167)
  (pt -4.65 -2.31)
  (pt -4.65 -2.66)
  (pt -4.25 -2.66)
  )
  )
  (layerContents (layerNumRef 20)
  (line (pt -3.76 0.34) (pt 3.76 0.34) (width 0.127))
  (line (pt 3.76 0.34) (pt 3.76 -4.11) (width 0.127))
  (line (pt 3.76 -4.11) (pt 3.76 -4.81) (width 0.127))
  (line (pt 3.76 -4.81) (pt -3.76 -4.81) (width 0.127))
  (line (pt -3.76 -4.81) (pt -3.76 -4.11) (width 0.127))
  (line (pt -3.76 -4.11) (pt -3.76 0.34) (width 0.127))
  (attr "RefDes" "" (pt -5.00279 1.59089) (justify LowerLeft) (isVisible True) (textStyleRef "(PinStyle)"))
  (attr "Type" "" (pt -5.30911 -6.81169) (justify LowerLeft) (isVisible True) (textStyleRef "(PinStyle)"))
  (text (pt 0.490973 -4.32808) "PCB EDGE" (justify LowerLeft) (isVisible True) (textStyleRef "(LabelStyle)"))
  (line (pt -3.76 -4.11) (pt 3.76 -4.11) (width 0.127))
  (arc (pt -1.3 0) (radius 0.1) (startAngle 0) (sweepAngle 360) (width 0.2))
  )
  (layerContents (layerNumRef 20)
  (line (pt -3.76 0.34) (pt 3.76 0.34) (width 0.127))
  (line (pt 3.76 0.34) (pt 3.76 -4.11) (width 0.127))
  (line (pt 3.76 -4.11) (pt 3.76 -4.81) (width 0.127))
  (line (pt 3.76 -4.81) (pt -3.76 -4.81) (width 0.127))
  (line (pt -3.76 -4.81) (pt -3.76 -4.11) (width 0.127))
  (line (pt -3.76 -4.11) (pt -3.76 0.34) (width 0.127))
  (attr "RefDes" "" (pt -5.00279 1.59089) (justify LowerLeft) (isVisible True) (textStyleRef "(PinStyle)"))
  (attr "Type" "" (pt -5.30911 -6.81169) (justify LowerLeft) (isVisible True) (textStyleRef "(PinStyle)"))
  (text (pt 0.490973 -4.32808) "PCB EDGE" (justify LowerLeft) (isVisible True) (textStyleRef "(LabelStyle)"))
  (line (pt -3.76 -4.11) (pt 3.76 -4.11) (width 0.127))
  (arc (pt -1.3 0) (radius 0.1) (startAngle 0) (sweepAngle 360) (width 0.2))
  )
  (layerContents (layerNumRef 10)
  (line (pt -4.7 -4.11) (pt -3.3 -4.11) (width 0.0001))
  (line (pt -3.3 -4.11) (pt -2.825 -3.61) (width 0.0001))
  (line (pt -2.825 -3.61) (pt -2.825 -2.51) (width 0.0001))
  (arc (pt -2.3875 -2.4975) (radius 0.437679) (startAngle 92) (sweepAngle 90) (width 0.0001))
  (arc (pt -2.3875 -2.5225) (radius 0.462669) (startAngle 2) (sweepAngle 90) (width 0.0001))
  (line (pt -1.925 -2.51) (pt -1.925 -3.61) (width 0.0001))
  (line (pt -1.925 -3.61) (pt -1.5 -4.11) (width 0.0001))
  (line (pt -1.5 -4.11) (pt 1.5 -4.11) (width 0.0001))
  (line (pt 1.5 -4.11) (pt 1.925 -3.61) (width 0.0001))
  (line (pt 1.925 -3.61) (pt 1.925 -2.51) (width 0.0001))
  (arc (pt 2.3875 -2.5225) (radius 0.462669) (startAngle 88) (sweepAngle 90) (width 0.0001))
  (arc (pt 2.3875 -2.4975) (radius 0.437679) (startAngle 358) (sweepAngle -270) (width 0.0001))
  (line (pt 2.825 -2.51) (pt 2.825 -3.61) (width 0.0001))
  (line (pt 2.825 -3.61) (pt 3.3 -4.11) (width 0.0001))
  (line (pt 3.3 -4.11) (pt 4.9 -4.11) (width 0.0001))
  (arc (pt 3.95 -2.31) (radius 0.3) (startAngle 0) (sweepAngle 90) (width 0.0001))
  (arc (pt 3.95 -2.31) (radius 0.3) (startAngle 90) (sweepAngle 90) (width 0.0001))
  (line (pt 3.65 -2.31) (pt 3.65 -3.01) (width 0.0001))
  (arc (pt 3.95 -3.01) (radius 0.3) (startAngle 180) (sweepAngle 90) (width 0.0001))
  (arc (pt 3.95 -3.01) (radius 0.3) (startAngle 270) (sweepAngle -270) (width 0.0001))
  (line (pt 4.25 -3.01) (pt 4.25 -2.31) (width 0.0001))
  (arc (pt -3.95 -2.31) (radius 0.3) (startAngle 0) (sweepAngle 90) (width 0.0001))
  (arc (pt -3.95 -2.31) (radius 0.3) (startAngle 90) (sweepAngle 90) (width 0.0001))
  (line (pt -4.25 -2.31) (pt -4.25 -3.01) (width 0.0001))
  (arc (pt -3.95 -3.01) (radius 0.3) (startAngle 180) (sweepAngle 90) (width 0.0001))
  (arc (pt -3.95 -3.01) (radius 0.3) (startAngle 270) (sweepAngle -270) (width 0.0001))
  (line (pt -3.65 -3.01) (pt -3.65 -2.31) (width 0.0001))
  )
  (layerContents (layerNumRef 6)
  (line (pt -3.76 -3.96) (pt -3.76 -4.81) (width 0.127))
  (line (pt -3.76 -4.81) (pt 3.76 -4.81) (width 0.127))
  (line (pt 3.76 -4.81) (pt 3.76 -3.96) (width 0.127))
  (line (pt -3.76 -1.36) (pt -3.76 0.34) (width 0.127))
  (line (pt -3.76 0.34) (pt -3.4 0.34) (width 0.127))
  (line (pt 3.4 0.34) (pt 3.76 0.34) (width 0.127))
  (line (pt 3.76 0.34) (pt 3.76 -1.36) (width 0.127))
  (arc (pt -1.3 1.25) (radius 0.1) (startAngle 0) (sweepAngle 360) (width 0.2))
  )
  (layerContents (layerNumRef 5)
  (pcbPoly
  (pt 3.65 -2.66)
  (pt 3.65 -2.31)
  (pt 3.65 -2.30215)
  (pt 3.65082 -2.28646)
  (pt 3.65246 -2.27083)
  (pt 3.65492 -2.25531)
  (pt 3.65819 -2.23994)
  (pt 3.66226 -2.22477)
  (pt 3.66711 -2.20983)
  (pt 3.67274 -2.19516)
  (pt 3.67913 -2.1808)
  (pt 3.68626 -2.1668)
  (pt 3.69412 -2.1532)
  (pt 3.70268 -2.14002)
  (pt 3.71191 -2.12731)
  (pt 3.7218 -2.1151)
  (pt 3.73231 -2.10342)
  (pt 3.74342 -2.09231)
  (pt 3.7551 -2.0818)
  (pt 3.76731 -2.07191)
  (pt 3.78002 -2.06268)
  (pt 3.7932 -2.05412)
  (pt 3.8068 -2.04627)
  (pt 3.8208 -2.03913)
  (pt 3.83515 -2.03274)
  (pt 3.84982 -2.02711)
  (pt 3.86476 -2.02226)
  (pt 3.87994 -2.01819)
  (pt 3.89531 -2.01492)
  (pt 3.91083 -2.01246)
  (pt 3.92645 -2.01082)
  (pt 3.94214 -2.01)
  (pt 3.95 -2.01)
  (pt 3.95785 -2.01)
  (pt 3.97354 -2.01082)
  (pt 3.98917 -2.01246)
  (pt 4.00469 -2.01492)
  (pt 4.02006 -2.01819)
  (pt 4.03523 -2.02226)
  (pt 4.05017 -2.02711)
  (pt 4.06484 -2.03274)
  (pt 4.0792 -2.03913)
  (pt 4.0932 -2.04626)
  (pt 4.1068 -2.05412)
  (pt 4.11998 -2.06268)
  (pt 4.13269 -2.07191)
  (pt 4.1449 -2.0818)
  (pt 4.15658 -2.09231)
  (pt 4.16769 -2.10342)
  (pt 4.1782 -2.1151)
  (pt 4.18809 -2.12731)
  (pt 4.19732 -2.14002)
  (pt 4.20588 -2.1532)
  (pt 4.21373 -2.1668)
  (pt 4.22087 -2.1808)
  (pt 4.22726 -2.19515)
  (pt 4.23289 -2.20982)
  (pt 4.23774 -2.22476)
  (pt 4.24181 -2.23994)
  (pt 4.24508 -2.25531)
  (pt 4.24754 -2.27083)
  (pt 4.24918 -2.28645)
  (pt 4.25 -2.30214)
  (pt 4.25 -2.31)
  (pt 4.25 -3.01)
  (pt 4.25 -3.01785)
  (pt 4.24918 -3.03354)
  (pt 4.24754 -3.04917)
  (pt 4.24508 -3.06469)
  (pt 4.24181 -3.08006)
  (pt 4.23774 -3.09523)
  (pt 4.23289 -3.11017)
  (pt 4.22726 -3.12484)
  (pt 4.22087 -3.1392)
  (pt 4.21374 -3.1532)
  (pt 4.20588 -3.1668)
  (pt 4.19732 -3.17998)
  (pt 4.18809 -3.19269)
  (pt 4.1782 -3.2049)
  (pt 4.16769 -3.21658)
  (pt 4.15658 -3.22769)
  (pt 4.1449 -3.2382)
  (pt 4.13269 -3.24809)
  (pt 4.11998 -3.25732)
  (pt 4.1068 -3.26588)
  (pt 4.0932 -3.27373)
  (pt 4.0792 -3.28087)
  (pt 4.06485 -3.28726)
  (pt 4.05018 -3.29289)
  (pt 4.03524 -3.29774)
  (pt 4.02006 -3.30181)
  (pt 4.00469 -3.30508)
  (pt 3.98917 -3.30754)
  (pt 3.97355 -3.30918)
  (pt 3.95786 -3.31)
  (pt 3.95 -3.31)
  (pt 3.94215 -3.31)
  (pt 3.92646 -3.30918)
  (pt 3.91083 -3.30754)
  (pt 3.89531 -3.30508)
  (pt 3.87994 -3.30181)
  (pt 3.86477 -3.29774)
  (pt 3.84983 -3.29289)
  (pt 3.83516 -3.28726)
  (pt 3.8208 -3.28087)
  (pt 3.8068 -3.27374)
  (pt 3.7932 -3.26588)
  (pt 3.78002 -3.25732)
  (pt 3.76731 -3.24809)
  (pt 3.7551 -3.2382)
  (pt 3.74342 -3.22769)
  (pt 3.73231 -3.21658)
  (pt 3.7218 -3.2049)
  (pt 3.71191 -3.19269)
  (pt 3.70268 -3.17998)
  (pt 3.69412 -3.1668)
  (pt 3.68627 -3.1532)
  (pt 3.67913 -3.1392)
  (pt 3.67274 -3.12485)
  (pt 3.66711 -3.11018)
  (pt 3.66226 -3.09524)
  (pt 3.65819 -3.08006)
  (pt 3.65492 -3.06469)
  (pt 3.65246 -3.04917)
  (pt 3.65082 -3.03355)
  (pt 3.65 -3.01786)
  (pt 3.65 -3.01)
  (pt 3.65 -2.66)
  (pt 3.25 -2.66)
  (pt 3.25 -3.01)
  (pt 3.25 -3.02833)
  (pt 3.25192 -3.06494)
  (pt 3.25575 -3.1014)
  (pt 3.26148 -3.1376)
  (pt 3.26911 -3.17346)
  (pt 3.2786 -3.20887)
  (pt 3.28992 -3.24374)
  (pt 3.30306 -3.27797)
  (pt 3.31797 -3.31146)
  (pt 3.33462 -3.34412)
  (pt
- Title
- Size:
- Date:
- A4
- Number:
- Time:
- Revision:
- Sheet
- of
- File:

### Library data of the parts
C7 = KCM55LR71E156KH01K: Capacitor; Manufacturer_Name: Murata Electronics; Datasheet Link: https://psearch.en.murata.com/capacitor/product/KCM55LR71E156KH01%23.html; Height: 3mm; Manufacturer_Part_Number: KCM55LR71E156KH01K; Mouser Part Number: 81-KCM55LR71E156KH1K; Mouser Price/Stock: https://www.mouser.com/ProductDetail/Murata-Electronics/KCM55LR71E156KH01K?qs=%2Fha2pyFadujTVicYMwxGf6al2IEnlbtrqh1JmJOdYSsKFh9aAuQRmXZk846chQr1
C8 = GRM32ER71C226KEA8L: Capacitor; Manufacturer_Name: Murata Electronics; Datasheet Link: http://psearch.en.murata.com/capacitor/product/GRM32ER71E226KE15%23.pdf; Height: 2.7mm; Manufacturer_Part_Number: GRM32ER71C226KEA8L; Mouser Part Number: 81-GRM32ER71C226KEAL; Mouser Price/Stock: https://www.mouser.com/Search/Refine.aspx?Keyword=81-GRM32ER71C226KEAL
F1 = MF-MSMF050-2: Fuse; Manufacturer_Name: Bourns; Allied_Number: 70153466; Datasheet Link: https://www.bourns.com/pdfs/mfmsmf.pdf; Height: 0.85mm; Manufacturer_Part_Number: MF-MSMF050-2; Mouser Part Number: 652-MF-MSMF050-2; Mouser Price/Stock: https://www.mouser.com/Search/Refine.aspx?Keyword=652-MF-MSMF050-2; RS Part Number: 6478156P; RS Price/Stock: http://uk.rs-online.com/web/p/products/6478156P; Allied Price/Stock: https://www.alliedelec.com/bourns-mf-msmf050-2/70153466/
J4 = 61900311121: Connector; Manufacturer_Name: Wurth Elektronik; Datasheet Link: https://katalog.we-online.de/em/datasheet/61900311121.pdf; Height: 11.75mm; Manufacturer_Part_Number: 61900311121; Mouser Part Number: 710-61900311121; Mouser Price/Stock: https://www.mouser.com/Search/Refine.aspx?Keyword=710-61900311121; RS Part Number: 8281474P; RS Price/Stock: http://uk.rs-online.com/web/p/products/8281474P
J19 = Header 2: as J18 on sheet Buck-regulator; Digi-Key Part Number: 2073-BG301-02-A-0540-L-BCT-ND; Value: *; Digikey Price/Stock: https://www.digikey.com/product-detail/en/gct/BG301-04-A-0540-L-B/2073-BG301-04-A-0540-L-BCT-ND/9859670?utm_source=snapeda&utm_medium=aggregator&utm_campaign=symbol
U3 = LM1117-3.3: 3V3 Low Dropout Regulator; Manufacturer_Part_Number: LM1117MPX-3.3/NOPB; Manufacturer_Name: Texas Instruments; Package: SOT-223-4 Texas Instruments; Price: None; Value: *; Mouser Price/Stock: https://www.mouser.com/ProductDetail/Texas-Instruments/LM1117MPX-33-NOPB?qs=X1J7HmVL2ZHRbBIxXi4utg%3D%3D; Mouser Part Number: 926-LM1117MPX3.3NOPB; Datasheet Link: http://www.ti.com/lit/ds/symlink/lm1117.pdf

## Sheet F_Antenna.SchDoc: F-Antenna
size A4; Organization: Team- Ashwathama; Address1: Colroado Boulder; Address2: Author- Deepesh Sonigra; Address3: Self Checking Shopping Cart; DocumentNumber: 1; Revision: 1.0; SheetNumber: 6; SheetTotal: 7
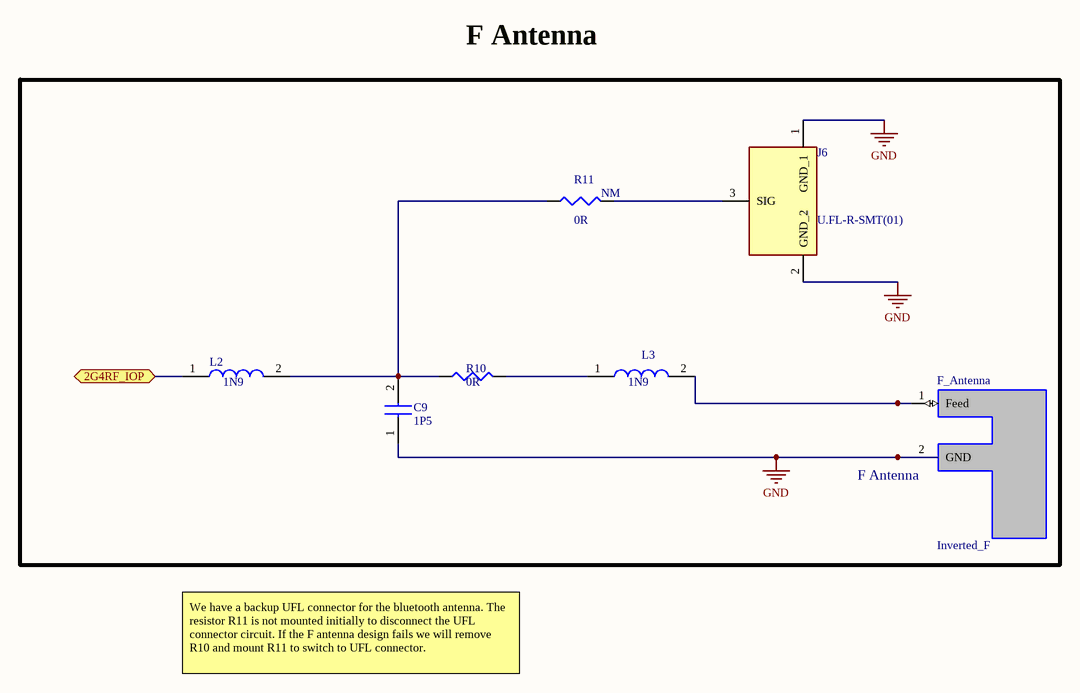
[diagram p3: F_Antenna.SchDoc]

### Parts
C9  value 1P5  [CAPC1005X55N]  (hidden comment: GRM1555C1H1R5WA01D)
F_Antenna  Inverted_F  [Inverted_F]
J6  U.FL-R-SMT(01)  [U.FL-R-SMT(01)]
L2  value 1N9  [INDC1005X45N]  (hidden comment: LQP15MN1N9W02D)
L3  value 1N9  [INDC1005X45N]  (hidden comment: LQP15MN1N9W02D)
R10  value 0R  [J1-0603]  (hidden comment: Res3)
R11  value 0R  Mounted: NM  [J1-0603]  (hidden comment: Res3)

### Blocks framed on the sheet
F Antenna: C9 F_Antenna J6 L2 L3 R10 R11

### Ports
2G4RF_IOP

### Nets
GND: C9.1 F_Antenna.2(GND) J6.1(GND_1) J6.2(GND_2)
NetC9_2: C9.2 L2.2 R10.1 R11.1
NetF_Antenna_1: F_Antenna.1(Feed) L3.2
NetJ6_3: J6.3(SIG) R11.2
NetL2_1: L2.1 ; port 2G4RF_IOP
NetL3_1: L3.1 R10.2

### Notes on the sheet
- F Antenna
- We have a backup UFL connector for the bluetooth antenna. The resistor R11 is not mounted initially to disconnect the UFL connector circuit. If the F antenna design fails we will remove R10 and mount R11 to switch to UFL connector.
- Title
- Size:
- Date:
- A4
- Number:
- Time:
- Revision:
- Sheet
- of
- File:

### Library data of the parts
C9 = GRM1555C1H1R5WA01D: Capacitor; Manufacturer_Name: Murata Electronics; Datasheet Link: http://www.murata.com/~/media/webrenewal/support/library/catalog/products/capacitor/mlcc/c02e.pdf; Height: 0.55mm; Manufacturer_Part_Number: GRM1555C1H1R5WA01D; Mouser Part Number: 81-GRM1555C1H1R5WA1D; Mouser Price/Stock: https://www.mouser.com/Search/Refine.aspx?Keyword=81-GRM1555C1H1R5WA1D; RS Part Number: 8145441; RS Price/Stock: https://uk.rs-online.com/web/p/products/8145441
J6 = U.FL-R-SMT(01): Connector; Manufacturer_Name: Hirose; Datasheet Link: https://www.hirose.com/product/en/download_file/key_name/U.FL-R-SMT-1%2832%29/category/Drawing%20(2D)/doc_file_id/37630/?file_category_id=6&item_id=03310472232&is_series=; Manufacturer_Part_Number: U.FL-R-SMT(01); Mouser Part Number: 798-U.FL-R-SMT01; Mouser Price/Stock: https://www.mouser.com/Search/Refine.aspx?Keyword=798-U.FL-R-SMT01; RS Part Number: 4812324P; RS Price/Stock: http://uk.rs-online.com/web/p/products/4812324P
L2 L3 = LQP15MN1N9W02D: Inductor; Manufacturer_Name: Murata Electronics; Datasheet Link: https://psearch.en.murata.com/inductor/product/LQP15MN1N9W02%23.html; Height: 0.45mm; Manufacturer_Part_Number: LQP15MN1N9W02D; Mouser Part Number: 81-LQP15MN1N9W02D; Mouser Price/Stock: https://www.mouser.com/Search/Refine.aspx?Keyword=81-LQP15MN1N9W02D; RS Part Number: 7859073P; RS Price/Stock: http://uk.rs-online.com/web/p/products/7859073P
R10 R11 = Res3: Resistor; Manufacturer_Name: Vishay Dale; Manufacturer_Part_Number: CRCW06030000Z0EAHP; Detailed Description: 0 Ohms Jumper 0.25W, 1/4W Chip Resistor 0603 (1608 Metric) Automotive AEC-Q200, Pulse Withstanding Thick Film; Digi-Key Part Number: 541-0.0SBCT-ND; Digikey Price/Stock: https://www.digikey.com/product-detail/en/vishay-dale/CRCW06030000Z0EAHP/541-0.0SBCT-ND/2222749

## Sheet Peripherals.SchDoc: Peripheral Connectors
size A4; Organization: Team Ashwathama; Address1: Colorado Boulder; Address2: Author- Deepesh Sonigra; Address3: Self Checkout Shopping Cart; DocumentNumber: 1; Revision: 1.0; SheetNumber: 7; SheetTotal: 7
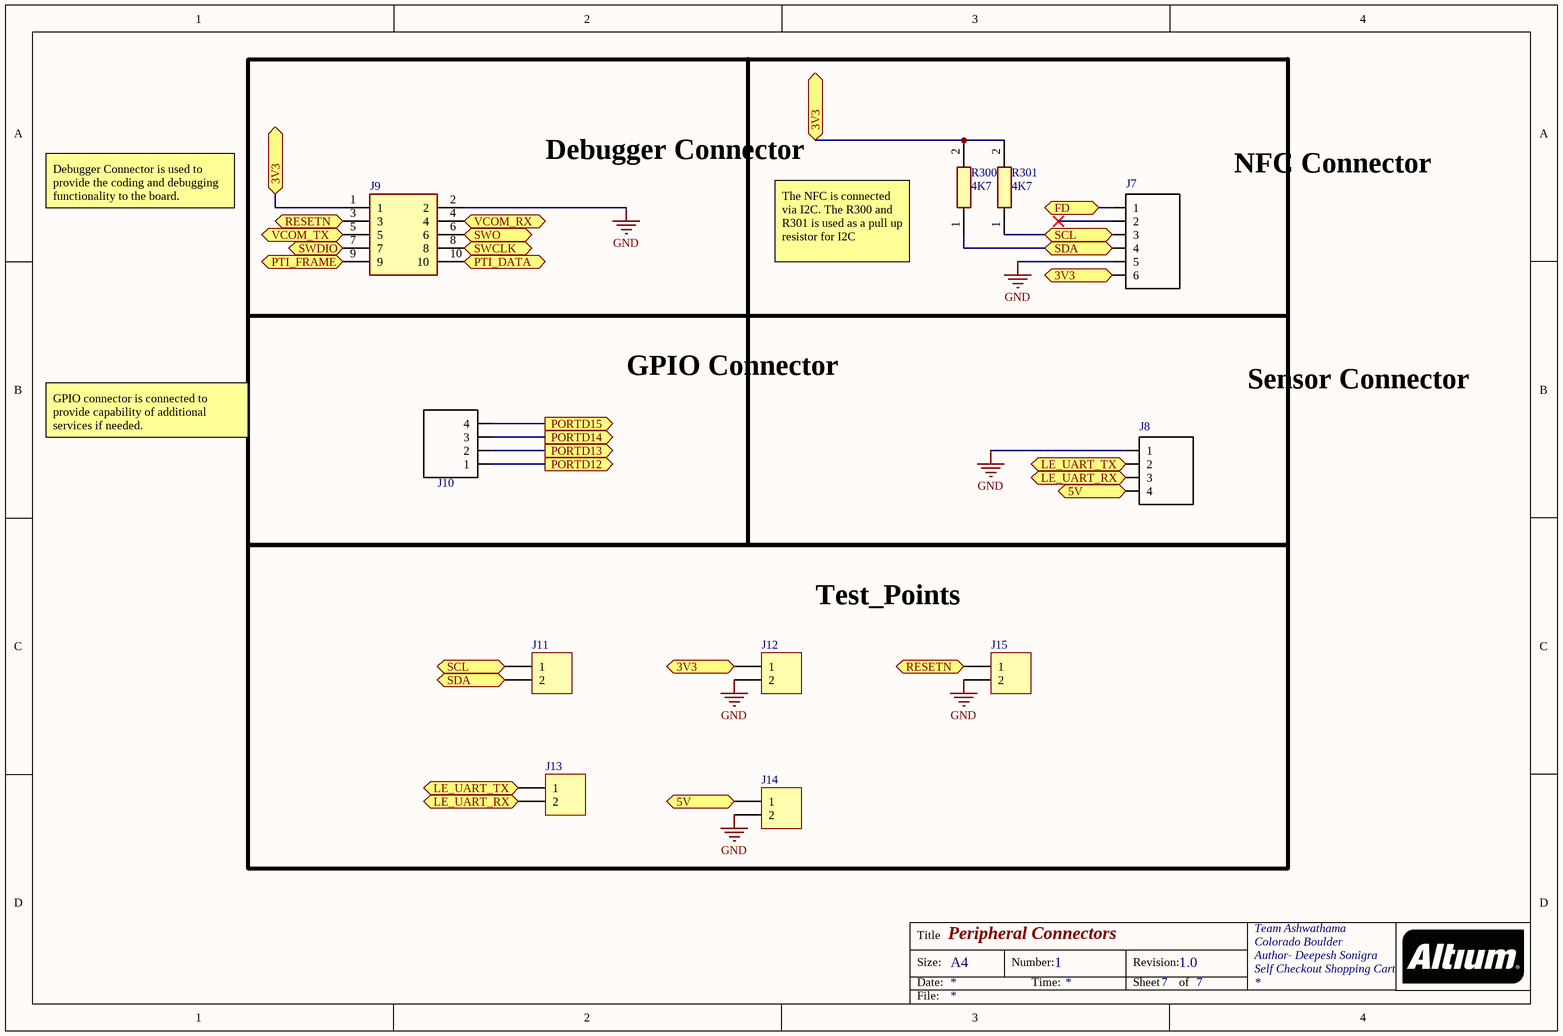
[diagram p4: Peripherals.SchDoc]

### Parts
J7  BG300-06-X-X-A_REVC  [*GCT_BG300-06-X-X-A_REVC]  (value not drawn)
J8  BG301-04-X-XXXX-X-X_REVC  [*GCT_BG301-04-X-XXXX-X-X_REVC]  (value not drawn)
J9  FTSH-105-01-L-DV-K-TR  [FTSH10501LDVKTR]  (value not drawn)
J10  BG301-04-X-XXXX-X-X_REVC  [*GCT_BG301-04-X-XXXX-X-X_REVC]  (value not drawn)
J11  Header 2  [HDR1X2]  (value not drawn)
J12  Header 2  [HDR1X2]  (value not drawn)
J13  Header 2  [HDR1X2]  (value not drawn)
J14  Header 2  [HDR1X2]  (value not drawn)
J15  Header 2  [HDR1X2]  (value not drawn)
R300  value 4K7  [RESC1608X50N]  (hidden comment: RCS06034K70FKEA)
R301  value 4K7  [RESC1608X50N]  (hidden comment: RCS06034K70FKEA)

### Blocks framed on the sheet
Test_Points: J11-J15

### Ports
3V3, 5V, FD, LE_UART_RX, LE_UART_TX, PORTD12, PORTD13, PORTD14, PORTD15, PTI_DATA, PTI_FRAME, RESETN, SCL, SDA, SWCLK, SWDIO, SWO, VCOM_RX, VCOM_TX

### Nets
GND: J7.5 J8.1 J9.2 J12.2 J14.2 J15.2
3V3: J7.6 J9.1 J12.1 R300.2 R301.2 ; port 3V3
RESET_N: J9.3 J15.1 ; port RESETN
NetJ4_3: J8.4 J14.1 ; port 5V
NetJ7_1: J7.1 ; port FD
NetJ7_3: J7.3 J11.1 R301.1 ; port SCL
NetJ7_4: J7.4 J11.2 R300.1 ; port SDA
NetJ8_2: J8.2 J13.1 ; port LE_UART_TX
NetJ8_3: J8.3 J13.2 ; port LE_UART_RX
NetJ9_4: J9.4 ; port VCOM_RX
NetJ9_5: J9.5 ; port VCOM_TX
NetJ9_6: J9.6 ; port SWO
NetJ9_7: J9.7 ; port SWDIO
NetJ9_8: J9.8 ; port SWCLK
NetJ9_9: J9.9 ; port PTI_FRAME
NetJ9_10: J9.10 ; port PTI_DATA
NetJ10_1: J10.1 ; port PORTD12
NetJ10_2: J10.2 ; port PORTD13
NetJ10_3: J10.3 ; port PORTD14
NetJ10_4: J10.4 ; port PORTD15

Not connected (* = marked no-connect by the designer): J7 2*

### Notes on the sheet
- (near J9) Debugger Connector
- NFC Connector
- Debugger Connector is used to provide the coding and debugging functionality to the board.
- The NFC is connected via I2C. The R300 and R301 is used as a pull up resistor for I2C
- (near J10) GPIO Connector
- GPIO connector is connected to provide capability of additional services if needed.
- Sensor Connector
- Title
- Size:
- Date:
- A4
- Number:
- Time:
- Revision:
- Sheet
- of
- File:

### Library data of the parts
J7 = BG300-06-X-X-A_REVC: 6 POS Right Angle Header; Manufacturer_Part_Number: BG300-06-A-L-A; Manufacturer_Name: Global Connector Technology; Detailed Description: 6 Position Receptacle Connector Surface Mount, Right Angle; Digikey Price/Stock: https://www.digikey.com/product-detail/en/gct/BG300-06-A-L-A/2073-BG300-06-A-L-ACT-ND/9859667?utm_source=snapeda&utm_medium=aggregator&utm_campaign=symbol; Digi-Key Part Number: 2073-BG300-06-A-L-ACT-ND; Value: *
J8 J10 = BG301-04-X-XXXX-X-X_REVC: 4 POS Right Angle Header; Manufacturer_Part_Number: BG301-04-A-0540-L-B; Manufacturer_Name: Global Connector Technology; Digikey Price/Stock: https://www.digikey.com/product-detail/en/gct/BG301-04-A-0540-L-B/2073-BG301-04-A-0540-L-BCT-ND/9859670?utm_source=snapeda&utm_medium=aggregator&utm_campaign=symbol; Digi-Key Part Number: 2073-BG301-04-A-0540-L-BCT-ND; Value: *; Detailed Description: *
J9 = FTSH-105-01-L-DV-K-TR: Connector; Manufacturer_Name: SAMTEC; Datasheet Link: http://suddendocs.samtec.com/catalog_english/ftsh_th.pdf; Height: 5.56mm; Manufacturer_Part_Number: FTSH-105-01-L-DV-K-TR; Mouser Part Number: 200-FTSH10501LDVKTR; Mouser Price/Stock: https://www.mouser.com/Search/Refine.aspx?Keyword=200-FTSH10501LDVKTR; RS Part Number: 1803002P; RS Price/Stock: http://uk.rs-online.com/web/p/products/1803002P
J11-J15 = Header 2: as J18 on sheet Buck-regulator; Digi-Key Part Number: 2073-BG301-02-A-0540-L-BCT-ND; Value: *; Digikey Price/Stock: https://www.digikey.com/product-detail/en/gct/BG301-04-A-0540-L-B/2073-BG301-04-A-0540-L-BCT-ND/9859670?utm_source=snapeda&utm_medium=aggregator&utm_campaign=symbol
R300 R301 = RCS06034K70FKEA: Resistor; Manufacturer_Name: Vishay; Datasheet Link: https://www.vishay.com/docs/20065/rcse3.pdf; Height: 0.5mm; Manufacturer_Part_Number: RCS06034K70FKEA; Mouser Part Number: 71-RCS06034K70FKEA; Mouser Price/Stock: https://www.mouser.com/Search/Refine.aspx?Keyword=71-RCS06034K70FKEA